# EAGLE design Arduino Shield (EAGLE 9.5.2)
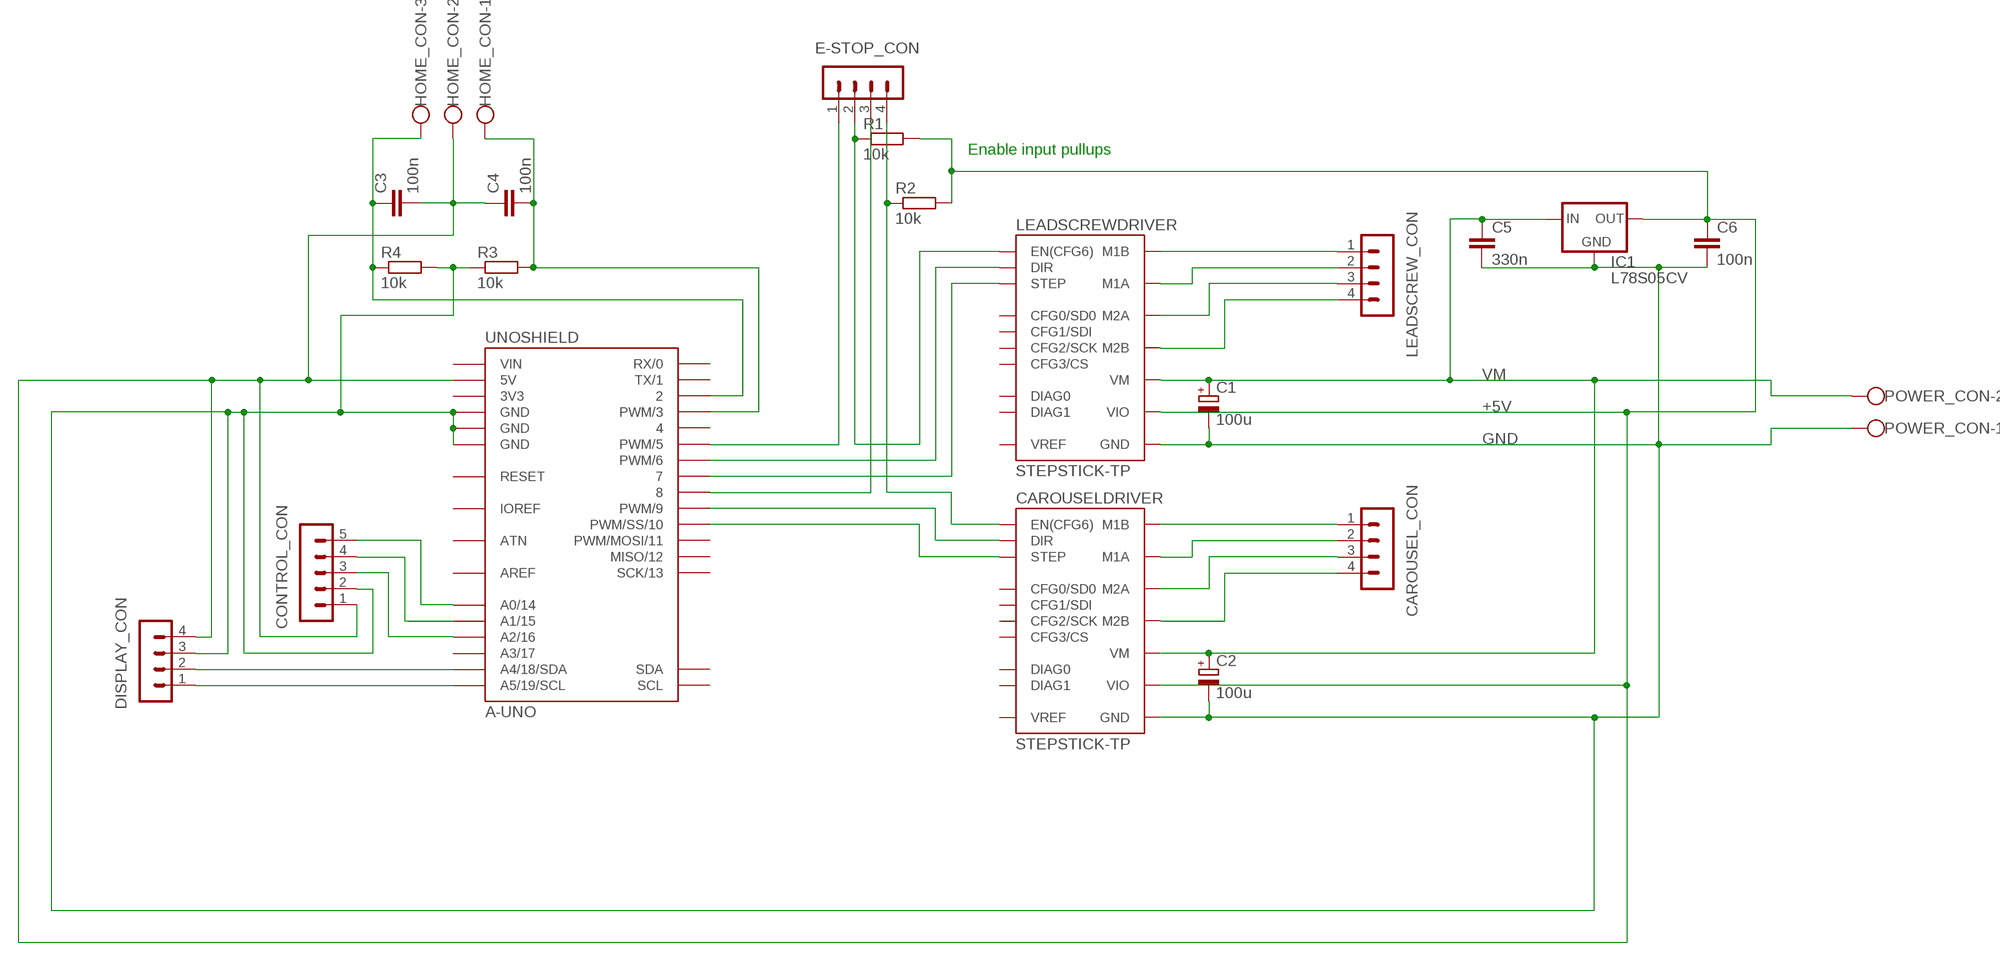
[diagram p0: schematic, sheet 1]

## Parts
C1  100u  CPOL-EUE3.5-8  [E3,5-8]
C2  100u  CPOL-EUE3.5-8  [E3,5-8]
C3  100n  C-EU025-024X044  [C025-024X044]
C4  100n  C-EU025-024X044  [C025-024X044]
C5  330n  C-EU025-030X050  [C025-030X050]
C6  100n  C-EU025-030X050  [C025-030X050]
CAROUSEL_CON  MA04-1  [MA04-1]
CAROUSELDRIVER  STEPSTICK-TP  [STEPSTICK_TP]
CONTROL_CON  MA05-1  [MA05-1]
DISPLAY_CON  MA04-1  [MA04-1]
E-STOP_CON  MA04-1  [MA04-1]
HOME_CON  W237-103  [W237-103]
IC1  L78S05CV  [TO-220-STANDING]
LEADSCREW_CON  MA04-1  [MA04-1]
LEADSCREWDRIVER  STEPSTICK-TP  [STEPSTICK_TP]
POWER_CON  W237-102  [W237-102]
R1  10k  R-EU_0207/12  [0207/12]
R2  10k  R-EU_0207/12  [0207/12]
R3  10k  R-EU_0207/10  [0207/10]
R4  10k  R-EU_0207/10  [0207/10]
UNOSHIELD  A-UNO  [A-UNO]

## Nets
+5V [Power]: C3.2 C4.1 C6.1 CAROUSELDRIVER.VIO CONTROL_CON.1 DISPLAY_CON.4 HOME_CON.2 IC1.3(OUT) LEADSCREWDRIVER.VIO R1.2 R2.2 UNOSHIELD.5V
GND [Power]: C1.- C2.- C5.2 C6.2 CAROUSELDRIVER.GND@1(GND) CAROUSELDRIVER.GND@2(GND) CONTROL_CON.2 DISPLAY_CON.3 IC1.2(GND) LEADSCREWDRIVER.GND@1(GND) LEADSCREWDRIVER.GND@2(GND) POWER_CON.1 R3.1 R4.2 UNOSHIELD.GND@1(GND) UNOSHIELD.GND@2(GND) UNOSHIELD.GND@3(GND)
N$1: E-STOP_CON.2 LEADSCREWDRIVER.EN(EN(CFG6)) R1.1
N$2: LEADSCREWDRIVER.DIR UNOSHIELD.6(PWM/6)
N$3: LEADSCREWDRIVER.STEP UNOSHIELD.7
N$4: CAROUSELDRIVER.EN(EN(CFG6)) E-STOP_CON.4 R2.1
N$5: CAROUSELDRIVER.DIR UNOSHIELD.9(PWM/9)
N$6: CAROUSELDRIVER.STEP UNOSHIELD.10(PWM/SS/10)
N$7 [Motors]: LEADSCREW_CON.1 LEADSCREWDRIVER.M1B
N$8 [Motors]: LEADSCREW_CON.2 LEADSCREWDRIVER.M1A
N$9 [Motors]: LEADSCREW_CON.4 LEADSCREWDRIVER.M2B
N$10 [Motors]: LEADSCREW_CON.3 LEADSCREWDRIVER.M2A
N$11 [Motors]: CAROUSEL_CON.1 CAROUSELDRIVER.M1B
N$12 [Motors]: CAROUSEL_CON.2 CAROUSELDRIVER.M1A
N$13 [Motors]: CAROUSEL_CON.3 CAROUSELDRIVER.M2A
N$14 [Motors]: CAROUSEL_CON.4 CAROUSELDRIVER.M2B
N$15: E-STOP_CON.1 UNOSHIELD.5(PWM/5)
N$16: E-STOP_CON.3 UNOSHIELD.8
N$17: DISPLAY_CON.1 UNOSHIELD.A5(A5/19/SCL)
N$18: DISPLAY_CON.2 UNOSHIELD.A4(A4/18/SDA)
N$19: C3.1 HOME_CON.3 R4.1 UNOSHIELD.2
N$20: CONTROL_CON.5 UNOSHIELD.A0(A0/14)
N$21: CONTROL_CON.4 UNOSHIELD.A1(A1/15)
N$22: CONTROL_CON.3 UNOSHIELD.A2(A2/16)
N$23: C4.2 HOME_CON.1 R3.2 UNOSHIELD.3(PWM/3)
VM [Power]: C1.+ C2.+ C5.1 CAROUSELDRIVER.VM IC1.1(IN) LEADSCREWDRIVER.VM POWER_CON.2
Unconnected: CAROUSELDRIVER.CFG1(CFG1/SDI) CAROUSELDRIVER.CFG2(CFG2/SCK) CAROUSELDRIVER.CFG3(CFG3/CS) CAROUSELDRIVER.DIAG0 CAROUSELDRIVER.DIAG1 CAROUSELDRIVER.NC/CFG0(CFG0/SD0) CAROUSELDRIVER.VREF LEADSCREWDRIVER.CFG1(CFG1/SDI) LEADSCREWDRIVER.CFG2(CFG2/SCK) LEADSCREWDRIVER.CFG3(CFG3/CS) LEADSCREWDRIVER.DIAG0 LEADSCREWDRIVER.DIAG1 LEADSCREWDRIVER.NC/CFG0(CFG0/SD0) LEADSCREWDRIVER.VREF UNOSHIELD.0(RX/0) UNOSHIELD.1(TX/1) UNOSHIELD.4 UNOSHIELD.11(PWM/MOSI/11) UNOSHIELD.12(MISO/12) UNOSHIELD.13(SCK/13) UNOSHIELD.A3(A3/17) UNOSHIELD.ATN UNOSHIELD.RST(RESET) UNOSHIELD.SCL UNOSHIELD.SDA

## Notes on the sheet
- Enable input pullups

## Power pins joined to a net without a drawn wire
3V3: UNOSHIELD.3V3
AREF: UNOSHIELD.AREF
IOREF: UNOSHIELD.IOREF
VIN: UNOSHIELD.VIN

## Library data of the parts
C1 C2 = rcl:CPOL-EU: POLARIZED CAPACITOR, European symbol; SPICEPREFIX: C
C3-C6 = rcl:C-EU: CAPACITOR, European symbol; SPICEPREFIX: C
CAROUSEL_CON DISPLAY_CON E-STOP_CON LEADSCREW_CON = con-lstb:MA04-1: PIN HEADER; OC_FARNELL: unknown; OC_NEWARK: unknown
CAROUSELDRIVER LEADSCREWDRIVER = we-board:STEPSTICK: SilentStepStick - Trinamic TMC2100/TMC2130 Stepper Motor Driver TMC2100 - CFG pins for configuration TMC2130 - SPI for configuration Pin CFG0/SDO only available on TMC2130 SilentStepStick.
CONTROL_CON = con-lstb:MA05-1: PIN HEADER; OC_FARNELL: unknown; OC_NEWARK: unknown
HOME_CON = con-wago-500:W237-103: WAGO SCREW CLAMP; MPN: 237-103; OC_FARNELL: unknown; OC_NEWARK: 18M7116
IC1 = L78S05CV:L78S05CV; AVAILABILITY: Unavailable; DESCRIPTION: L78S05 Series 2 A 5 V Fixed Output Positive Voltage Regulator - TO-220; MF: STMicroelectronics; MP: L78S05CV; PACKAGE: TO-220 STMicroelectronics; PRICE: None
POWER_CON = con-wago-500:W237-102: WAGO SCREW CLAMP; MPN: 237-102; OC_FARNELL: unknown; OC_NEWARK: 70K9898
R1-R4 = rcl:R-EU_: RESISTOR, European symbol; SPICEPREFIX: R
UNOSHIELD = we-board:A-UNO: Arduino/Genuino Uno

## Net classes
1 Power: width 0.508 mm
2 Motors: width 0.381 mm

## Board
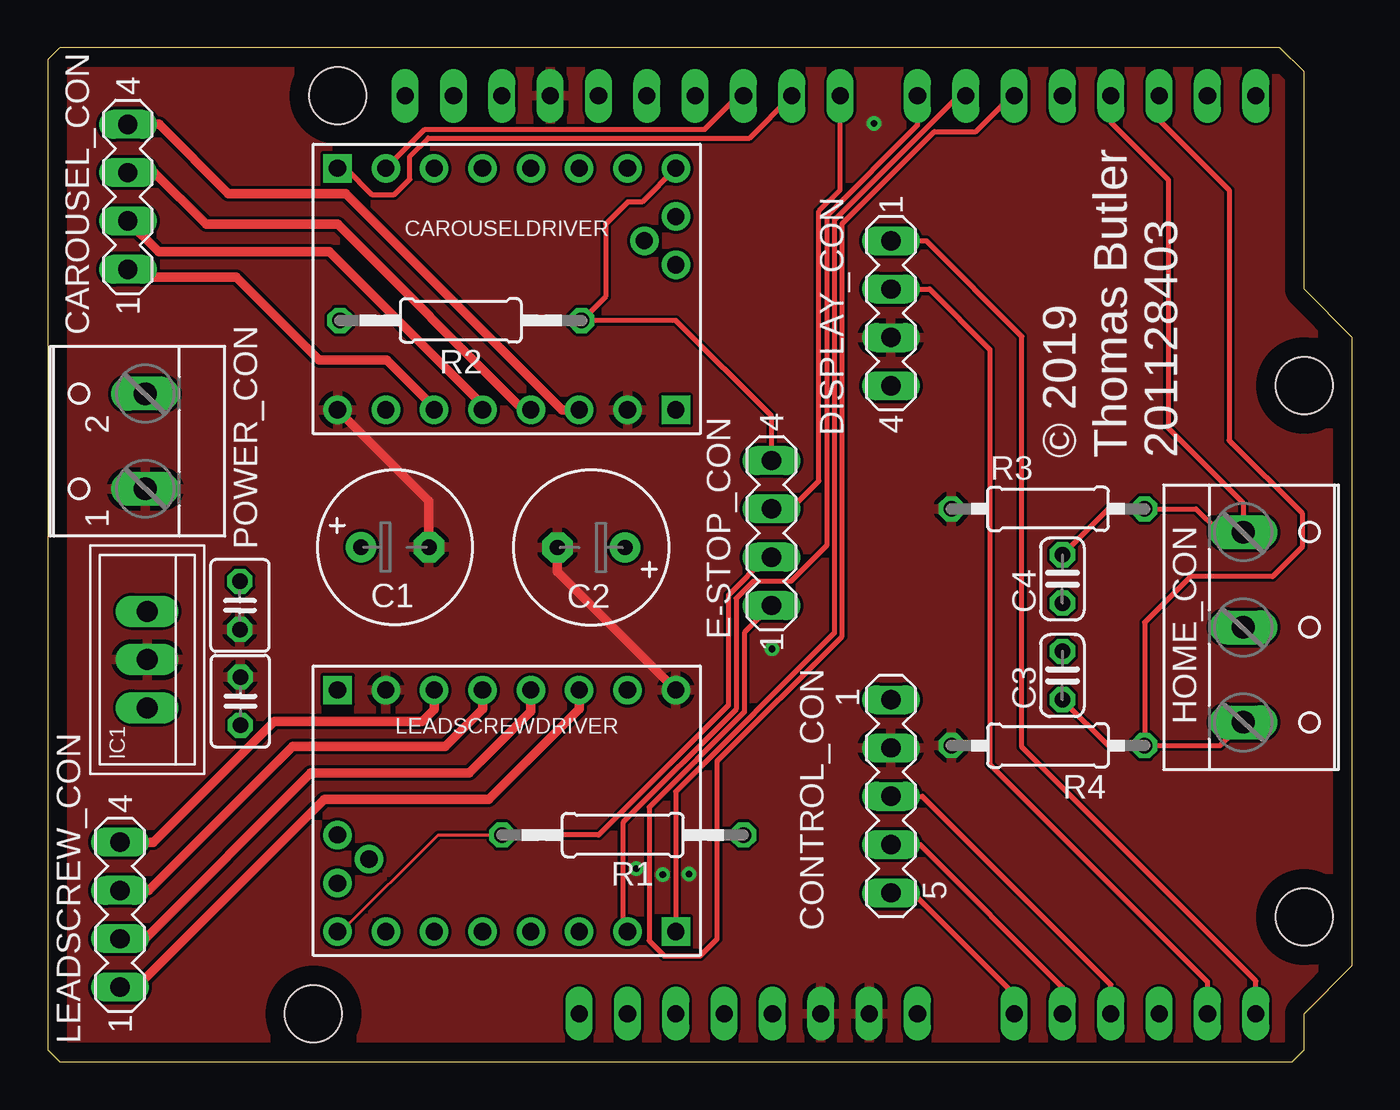
[diagram p1: board, top side]
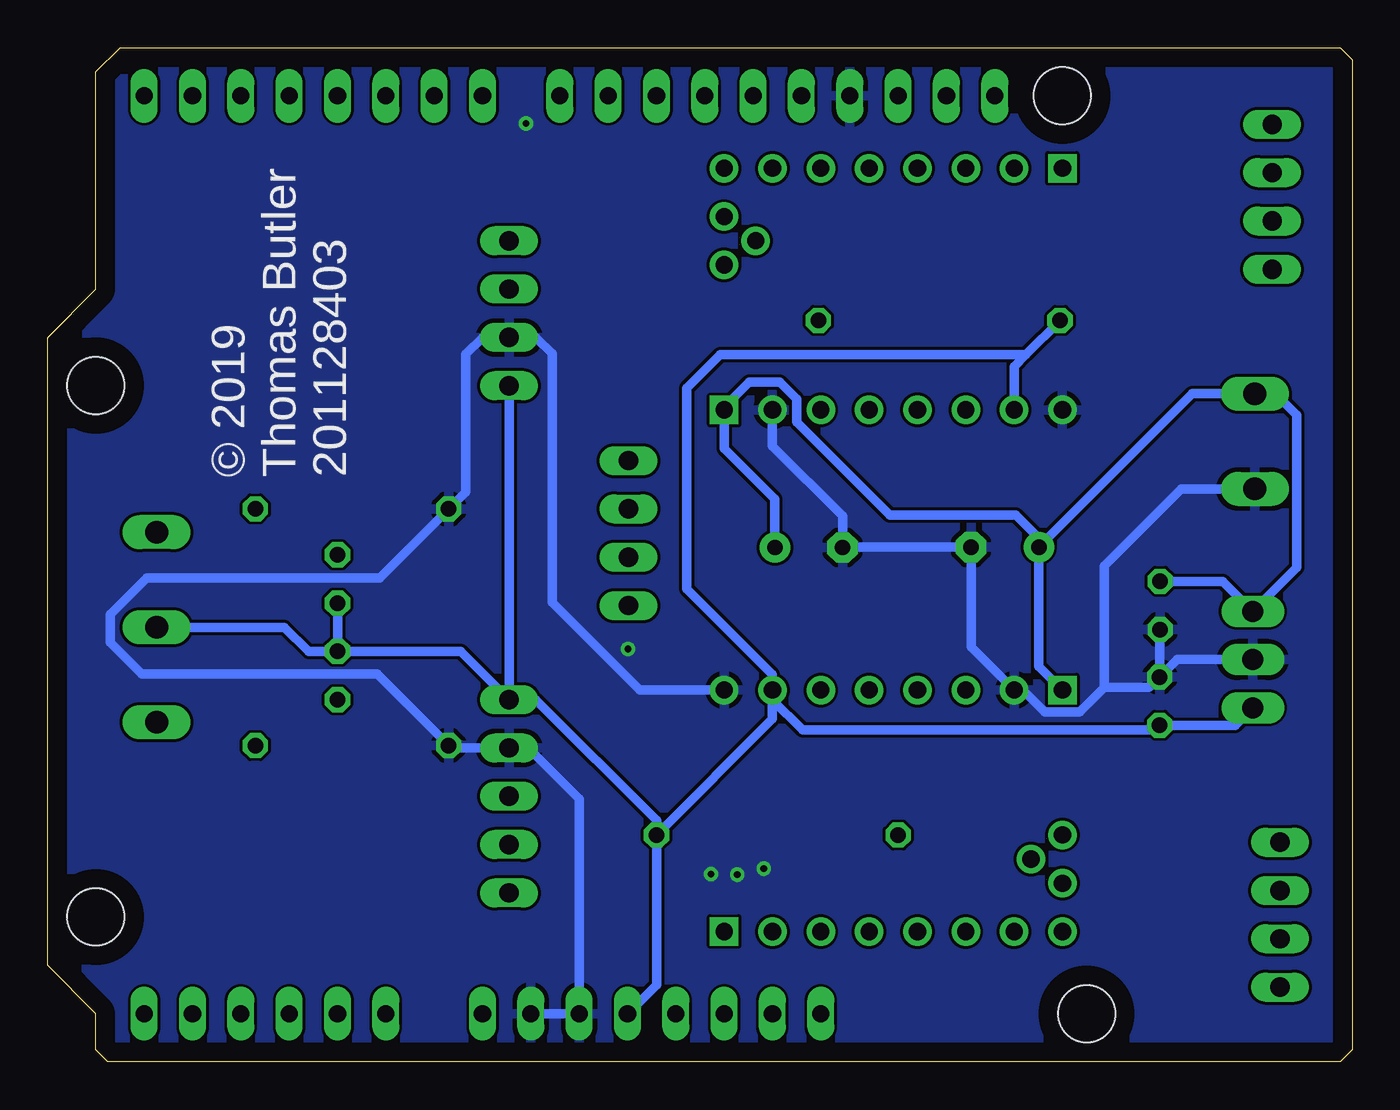
[diagram p2: board, bottom side, seen from below]

Size 68.58 x 53.34 mm. Coordinates in mm from the lower left corner, seen from the top.
Copper layers (1*16): Top 0.035mm / dielectric 1.5mm / Bottom 0.035mm
Design rules "default *": minimum track width 6mil, minimum drill 0.35mm, track to track 6mil, track to pad 6mil, pad to pad 6mil, via to via 6mil, smd to smd 6mil, copper to edge 40mil, drill to drill 6mil, minimum pad ring 10mil, minimum via ring 8mil, stop-mask expansion 4mil, vias tented up to drill 0mil, thermal gap 10mil

### Footprints (pad centres in the part's own frame; a part is rotated, then mirrored left to right if it is on the bottom)
E3,5-8 = drill 0.813 pad 1.6: + -1.778,0 | drill 0.813 pad 1.6 octagon: - 1.778,0
C025-024X044 = drill 0.813 octagon: 1 -1.27,0; 2 1.27,0
C025-030X050 = drill 0.813 octagon: 1 -1.27,0; 2 1.27,0
MA04-1 = drill 1.016 long: 1 -3.81,0; 2 -1.27,0; 3 1.27,0; 4 3.81,0
STEPSTICK_TP = drill 0.9 pad 1.5: CFG1 -6.35,6.35; CFG2 -6.35,3.81; CFG3 -6.35,1.27; DIAG0 -2.54,7.239; DIAG1 -1.27,8.89; EN -6.35,8.89; GND@1 6.35,6.35; GND@2 6.35,-8.89; M1A 6.35,-1.27; M1B 6.35,-3.81; M2A 6.35,1.27; M2B 6.35,3.81; NC -6.35,-3.81; NC/CFG0 -6.35,-1.27; STEP -6.35,-6.35; VIO 6.35,-6.35; VREF -3.81,8.89 | drill 0.9 pad 1.5 square: DIR -6.35,-8.89; VM 6.35,8.89
MA05-1 = drill 1.016 long: 1 -5.08,0; 2 -2.54,0; 3 0,0; 4 2.54,0; 5 5.08,0
W237-103 = drill 1.194 long: 1 -5,-1.29; 2 0,-1.29; 3 5,-1.29
TO-220-STANDING = drill 1.1 long: 1 -2.54,0; 2 0,0; 3 2.54,0
W237-102 = drill 1.194 long: 1 -2.5,-1.27; 2 2.5,-1.27
0207/12 = drill 0.813 octagon: 1 -6.35,0; 2 6.35,0
0207/10 = drill 0.813 octagon: 1 -5.08,0; 2 5.08,0
A-UNO = drill 0.9 pad 1.2 long: 0 63.5,50.8; 1 60.96,50.8; 2 58.42,50.8; 3 55.88,50.8; 3V3 35.56,2.54; 4 53.34,50.8; 5 50.8,50.8; 5V 38.1,2.54; 6 48.26,50.8; 7 45.72,50.8; 8 41.656,50.8; 9 39.116,50.8; 10 36.576,50.8; 11 34.036,50.8; 12 31.496,50.8; 13 28.956,50.8; A0 50.8,2.54; A1 53.34,2.54; A2 55.88,2.54; A3 58.42,2.54; A4 60.96,2.54; A5 63.5,2.54; AREF 23.876,50.8; ATN 27.94,2.54; GND@1 40.64,2.54; GND@2 43.18,2.54; GND@3 26.416,50.8; IOREF 30.48,2.54; RST 33.02,2.54; SCL 18.796,50.8; SDA 21.336,50.8; VIN 45.72,2.54 | hole 3: 66.04,35.56; 66.04,7.62; 15.24,50.8; 13.97,2.54

### Placement (x,y rotation side)
C1  18.26,27.08 0 top
C2  28.58,27.05 180 top
C3  53.34,20.32 90 top
C4  53.34,25.4 90 top
C5  10.11,24 270 top
C6  10.13,18.97 90 top
CAROUSEL_CON  4.22,45.49 90 top
CAROUSELDRIVER  24.13,40.64 270 top
CONTROL_CON  44.32,13.97 270 top
DISPLAY_CON  44.32,39.37 270 top
E-STOP_CON  38.05,27.81 90 top
HOME_CON  64.14,22.86 270 top
IC1  5.23,21.16 270 top
LEADSCREW_CON  3.81,7.75 90 top
LEADSCREWDRIVER  24.13,13.21 90 top
POWER_CON  3.86,32.64 90 top
R1  30.23,11.94 0 top
R2  21.72,38.99 180 top
R3  52.58,29.08 0 top
R4  52.58,16.64 180 top
UNOSHIELD  0,0 0 top

### Tracks (layer width: path | path; a pad name or v marks a point on that pad's centre or on a via)
+5V
  Bottom 0.508: LEADSCREWDRIVER.VIO 30.48,18.03 R1.2 | UNOSHIELD.5V 36.58,4.06 R1.2 | CAROUSELDRIVER.VIO 17.78,36.58 17.16,37.2 | C4.1 C3.2 | CONTROL_CON.1 46.86,21.59 C3.2 | HOME_CON.2 56.13,22.86 54.86,21.59 C3.2 | DISPLAY_CON.4 CONTROL_CON.1 | LEADSCREWDRIVER.VIO 30.48,20.37 34.99,24.87 34.99,35.44 33.23,37.2 17.16,37.2 | IC1.3 6.15,17.7 C6.1 10.39,17.45 28.88,17.45 30.48,19.05 LEADSCREWDRIVER.VIO | R1.2 36.58,12.7 42.93,19.05 CONTROL_CON.1 | R2.2 17.16,37.2
GND  (via drill 0.35)
  Top 0.508: CAROUSELDRIVER.GND@2 20.04,29.49 C1.- | C2.- 26.8,25.78 LEADSCREWDRIVER.GND@2
  Bottom 0.508: UNOSHIELD.GND@2 UNOSHIELD.GND@1 40.64,13.84 43.31,16.51 CONTROL_CON.2 47.37,16.51 R4.2 51.26,20.4 63.63,20.4 65.3,22.07 65.3,23.53 63.37,25.45 51.13,25.45 R3.1 46.61,29.97 46.61,37.21 45.72,38.1 DISPLAY_CON.3 42.93,38.1 42.06,37.24 42.06,24.15 37.47,19.56 LEADSCREWDRIVER.GND@2 | CAROUSELDRIVER.GND@1 30.48,32.38 26.8,28.7 C2.- 26.77,27.08 C1.- 20.04,21.82 LEADSCREWDRIVER.GND@1 17.31,19.56 16.16,18.4 14.32,18.4 13.04,19.68 | POWER_CON.1 8.99,30.14 13.04,26.09 13.04,19.68 | IC1.2 9.22,21.16 C6.2 | C5.2 10.14,22.71 C6.2 | C6.2 10.7,19.68 13.04,19.68
  other vias: 43.43,49.35 38.07,21.72 32.33,9.86 33.71,9.88 30.94,10.16
  pour Bottom: -12.8,-2.31 -12.8,50.39 -3.12,60.07 68.07,60.07 88.01,40.13 88.01,13.46 61.72,-12.83 -2.29,-12.83
  pour Top: -14.99,-14.1 -14.99,52.83 -1.14,66.67 73.66,66.67 92.2,48.13 92.2,1.78 69.09,-21.34 -7.75,-21.34
N$1
  Top 0.152: LEADSCREWDRIVER.EN 15.32,6.78 15.37,6.78 20.52,11.94 R1.1
  Top 0.254: R1.1 28.96,11.94 35.79,18.77 35.79,24.56 37.77,26.54 E-STOP_CON.2
N$2
  Top 0.254: UNOSHIELD.6 47.88,50.8 41.35,44.27 41.35,22.55 33.01,14.21 33.01,6.87 LEADSCREWDRIVER.DIR
N$3
  Top 0.254: UNOSHIELD.7 45.72,49.25 40.95,44.47 40.95,27.15 39.06,25.27 37.08,25.27 36.2,24.38 36.2,18.55 30.24,12.59 30.24,7.1 LEADSCREWDRIVER.STEP
N$4
  Top 0.254: E-STOP_CON.4 38.05,33.96 33.02,38.99 R2.1 29.32,40.25 29.32,44.06 30.48,45.21 31.24,45.21 CAROUSELDRIVER.EN
N$5
  Top 0.254: CAROUSELDRIVER.DIR 15.66,46.99 17.05,45.6 18.23,45.6 19.04,46.41 19.04,47.62 20,48.58 36.89,48.58 UNOSHIELD.9
N$6
  Top 0.254: CAROUSELDRIVER.STEP 19.83,49.04 34.55,49.04 36.31,50.8 UNOSHIELD.10
N$7
  Top 0.508: LEADSCREW_CON.1 4.65,3.94 14.53,13.82 23.2,13.82 27.94,18.56 LEADSCREWDRIVER.M1B
N$8
  Top 0.508: LEADSCREW_CON.2 5.13,6.48 13.84,15.19 22.16,15.19 25.4,18.43 LEADSCREWDRIVER.M1A
N$9
  Top 0.508: LEADSCREW_CON.4 5.56,11.56 11.91,17.91 19.69,17.91 20.32,18.54 LEADSCREWDRIVER.M2B
N$10
  Top 0.508: LEADSCREW_CON.3 5.31,9.02 12.88,16.59 20.89,16.59 22.86,18.56 LEADSCREWDRIVER.M2A
N$11
  Top 0.508: CAROUSELDRIVER.M1B 20.32,34.42 17.83,36.91 14.29,36.91 9.92,41.27 4.62,41.27 CAROUSEL_CON.1
N$12
  Top 0.508: CAROUSEL_CON.2 5.84,42.6 14.81,42.6 22.86,34.54 CAROUSELDRIVER.M1A
N$13
  Top 0.508: CAROUSEL_CON.3 5.61,46.76 8.33,44.04 15.24,44.04 24.99,34.29 CAROUSELDRIVER.M2A
N$14
  Top 0.508: CAROUSELDRIVER.M2B 27.05,34.29 15.67,45.67 9.5,45.67 5.87,49.3 CAROUSEL_CON.4
N$15
  Top 0.254: E-STOP_CON.1 36.63,22.58 36.63,18.41 31.61,13.39 31.61,6.37 32.41,5.57 34.29,5.57 35.19,6.47 35.19,15.82 41.76,22.39 41.76,44.07 46.61,48.92 48.79,48.92 50.67,50.8 UNOSHIELD.5
N$16
  Top 0.254: E-STOP_CON.3 39.06,29.08 40.54,30.56 40.54,44.73 41.66,45.85 UNOSHIELD.8
N$17
  Top 0.254: UNOSHIELD.A5 63.5,4.27 51.21,16.56 51.21,38.15 46.18,43.18 DISPLAY_CON.1
N$18
  Top 0.254: DISPLAY_CON.2 46.36,40.64 49.53,37.46 49.53,15.65 60.96,4.22 UNOSHIELD.A4
N$19
  Top 0.254: C3.1 55.75,16.64 R4.1 | R4.1 61.62,16.64 HOME_CON.3 | UNOSHIELD.2 58.42,49.53 62.1,45.85 62.1,32.68 65.93,28.86 65.93,27.07 64.39,25.53 60.07,25.53 57.66,23.11 R4.1
N$20
  Top 0.254: CONTROL_CON.5 45.47,8.89 50.8,3.56 UNOSHIELD.A0
N$21
  Top 0.254: CONTROL_CON.4 45.85,11.43 53.34,3.94 UNOSHIELD.A1
N$22
  Top 0.254: CONTROL_CON.3 45.97,13.97 55.88,4.06 UNOSHIELD.A2
N$23
  Top 0.254: C4.2 55.75,29.08 R3.2 60.35,29.08 61.58,27.86 HOME_CON.1 62.84,29.38 58.9,33.33 58.9,46.38 55.88,49.4 UNOSHIELD.3
VM
  Bottom 0.508: C2.+ 30.35,29.59 33,32.24 33,34.29 | 33,34.29 CAROUSELDRIVER.VM | 33,34.29 33,34.44 31.7,35.75 30.1,35.75 29.2,34.84 29.2,33.66 24.3,28.77 17.69,28.77 16.48,27.56 C1.+ | C1.+ 8.42,35.14 POWER_CON.2 4.07,35.14 2.93,34.01 2.93,26 IC1.1 6.81,25.27 C5.1 | C1.+ 16.48,20.8 LEADSCREWDRIVER.VM

### Text on the board
tNames: © 2019 / Thomas Butler / 201128403
bNames: © 2019 / Thomas Butler / 201128403